# Altium schematic sheet mikro.SchDoc
size A4; SheetNumber: 1; SheetTotal: 1
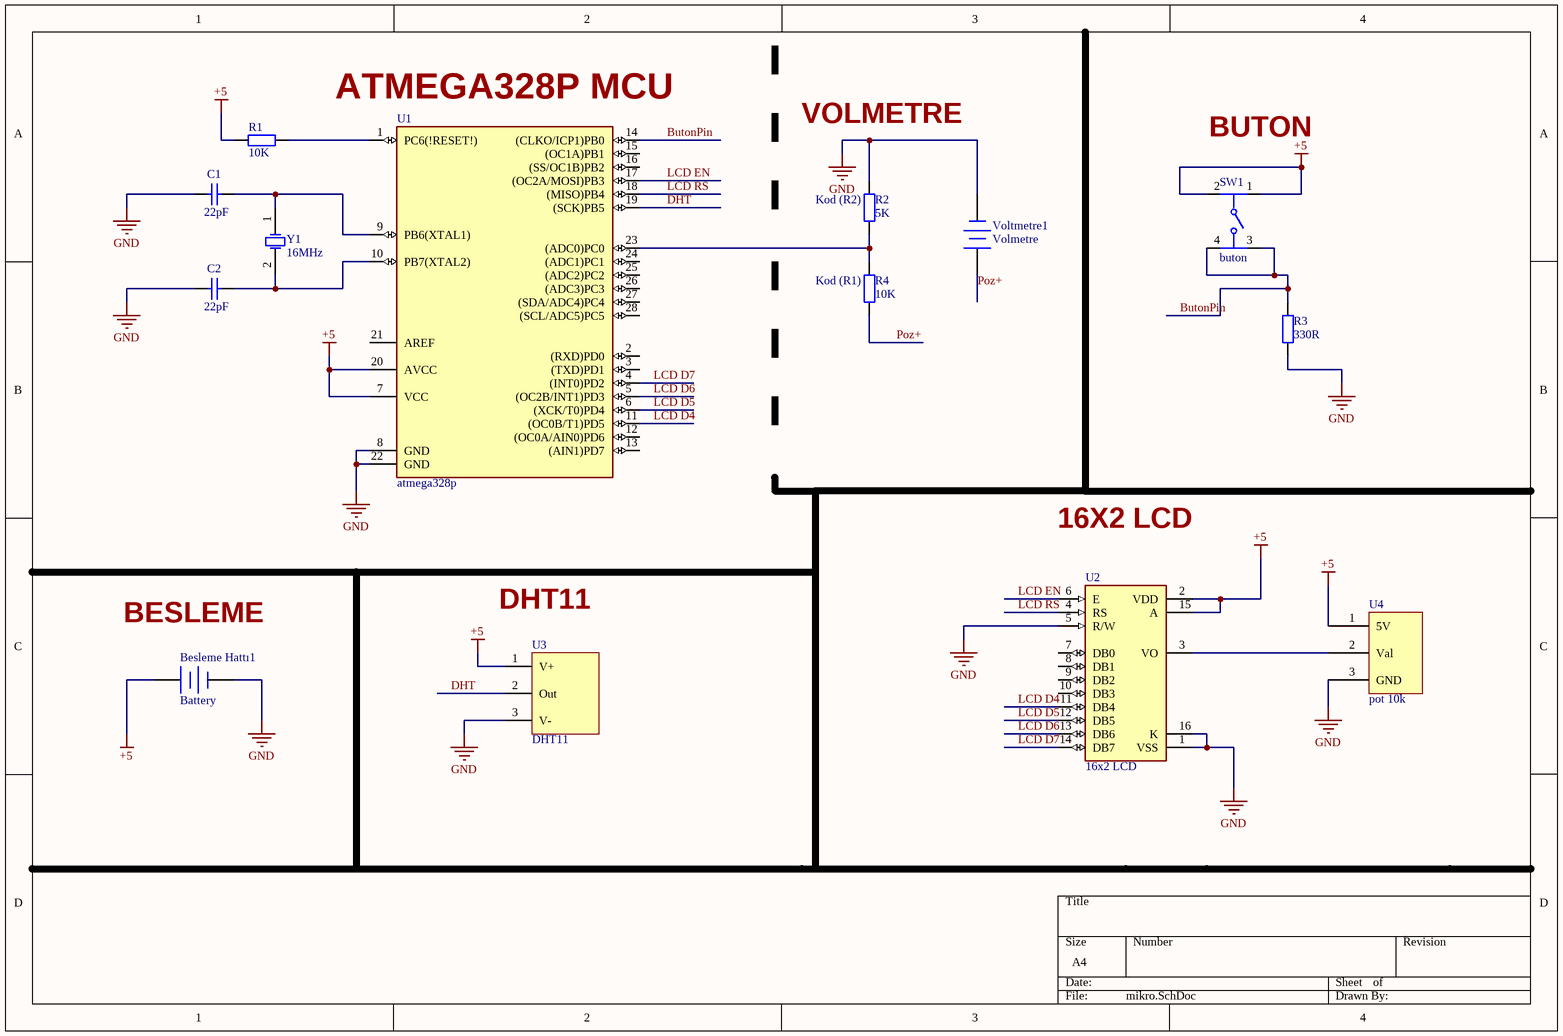
[diagram p0: mikro.SchDoc]

## Parts
Besleme_Hattı1  Battery  [BAT-2]
C1  22pF  [RAD-0.3]
C2  22pF  [RAD-0.3]
R1  value 10K  [AXIAL-0.4]  (hidden comment: res)
R2  value 5K  [AXIAL-0.4]  (hidden comment: res)
R3  value 330R  [AXIAL-0.4]  (hidden comment: res)
R4  value 10K  [AXIAL-0.4]  (hidden comment: res)
SW1  buton  [FP-1825910-2-0]
U1  atmega328p  [atmega328p]
U2  16x2 LCD  [16x2 LCD]
U3  DHT11  [DHT11]
U4  pot 10k  [pot 10k]
Voltmetre1  Volmetre  [BAT-2]
Y1  16MHz  [R38]

## Nets
+5: Besleme_Hattı1.1(+) R1.1 SW1.1 SW1.2 U1.7(VCC) U1.20(AVCC) U2.2(VDD) U2.15(A) U3.1(V+) U4.1(5V)
GND: Besleme_Hattı1.2(-) C1.1 C2.1 R2.2 R3.1 U1.8(GND) U1.22(GND) U2.1(VSS) U2.5(R/W) U2.16(K) U3.3(V-) U4.3(GND) Voltmetre1.2(-)
ButonPin: R3.2 SW1.3 SW1.4 U1.14((CLKO/ICP1)PB0)
DHT: U1.19((SCK)PB5) U3.2(Out)
LCD D4: U1.11((OC0B/T1)PD5) U2.11(DB4)
LCD D5: U1.6((XCK/T0)PD4) U2.12(DB5)
LCD D6: U1.5((OC2B/INT1)PD3) U2.13(DB6)
LCD D7: U1.4((INT0)PD2) U2.14(DB7)
LCD EN: U1.17((OC2A/MOSI)PB3) U2.6(E)
LCD RS: U1.18((MISO)PB4) U2.4(RS)
Poz+: R4.1 Voltmetre1.1(+)
NetC1_2: C1.2 U1.9(PB6(XTAL1)) Y1.1(OSC1)
NetC2_2: C2.2 U1.10(PB7(XTAL2)) Y1.2(OSC2)
NetR1_2: R1.2 U1.1(PC6(!RESET!))
NetR2_1: R2.1 R4.2 U1.23((ADC0)PC0)
NetU2_3: U2.3(VO) U4.2(Val)

Not connected (* = marked no-connect by the designer): U1 2((RXD)PD0) 3((TXD)PD1) 12((OC0A/AIN0)PD6) 13((AIN1)PD7) 15((OC1A)PB1) 16((SS/OC1B)PB2) 21(AREF) 24((ADC1)PC1) 25((ADC2)PC2) 26((ADC3)PC3) 27((SDA/ADC4)PC4) 28((SCL/ADC5)PC5); U2 7(DB0) 8(DB1) 9(DB2) 10(DB3)

## Notes on the sheet
- (near U1) ATMEGA328P MCU
- VOLMETRE
- (near SW1) BUTON
- (near R2) Kod (R2)
- (near R4) Kod (R1)
- 16X2 LCD
- (near Besleme_Hattı1) BESLEME
- (near U3) DHT11

## Library data of the parts
Besleme_Hattı1 = Battery: Multicell Battery; Published: 24-Mar-1999; LatestRevisionDate: 17-Jul-2002; LatestRevisionNote: Re-released for DXP Platform.; PackageReference: BAT-2; Publisher: Altium Limited; PackageDescription: Battery; 2 Leads
C1 C2 = Cap: Capacitor; Published: 8-Jun-2000; LatestRevisionDate: 17-Jul-2002; LatestRevisionNote: Re-released for DXP Platform.; PackageReference: RAD-0.3; Publisher: Altium Limited; PackageDescription: Radial Cap, Thru-Hole; 2 Leads; 0.3 in Pin Spacing; Value: 22pF
R1-R4 = Res2: Resistor; Published: 8-Jun-2000; LatestRevisionDate: 17-Jul-2002; LatestRevisionNote: Re-released for DXP Platform.; PackageReference: AXIAL-0.4; Publisher: Altium Limited; PackageDescription: Axial Device, Thru-Hole; 2 Leads; 0.4 in Pin Spacing
SW1 = CMP-03407-000004-1: SWITCH TACTILE SPST-NO 0.05A 24V; Manufacturer: TE; Manufacturer Part Number: 1825910-2; Contact Current Rating: 50mA; Operating Force: 160gf; Contact Resistance: 100mΩ; Electromechanical Life: 100000Cycles; Package: 0; ComponentLink2Description: Datasheet; Digikey Description: SWITCH TACTILE SPST-NO 0.05A 24V; Octopart: https://octopart.com/1825910-2-te+connectivity-42270502; Temperature Range Low: -35°C; Temperature Range High: +85°C; Lead Free: Yes; Device Class L2: Switches; Automotive: No; Temperature: -35°C to +85°C; Device Class L1: Electromechanical; Category: Switch; ComponentLink2URL: https://www.te.com/commerce/DocumentDelivery/DDEController?Action=showdoc&DocId=Customer+Drawing%7F1825910%7FC10%7Fpdf%7FEnglish%7FENG_CD_1825910_C10.pdf%7F1825910-2; Mount: Through Hole; RoHS: TRUE; Height: 4.6mm; Device Class L3: Tactile Switches; Voltage Rating Dc: 24V; Throw Configuration: SPST-NO
Voltmetre1 = Battery: Volmetre ucları; Published: 24-Mar-1999; LatestRevisionDate: 17-Jul-2002; LatestRevisionNote: Re-released for DXP Platform.; PackageReference: BAT-2; Publisher: Altium Limited; PackageDescription: Battery; 2 Leads
Y1 = XTAL: 16MHZ Crystal Oscillator; Published: 8-Jun-2000; LatestRevisionDate: 17-Jul-2002; LatestRevisionNote: Re-released for DXP Platform.; PackageReference: R38; Publisher: Altium Limited; PackageDescription: Crystal, Thru-Hole; 2 Leads; Body 3.1 x 8.2 mm (Dia.xH)